# EAGLE design ODU Display Line 0603 (EAGLE 9.6.2)
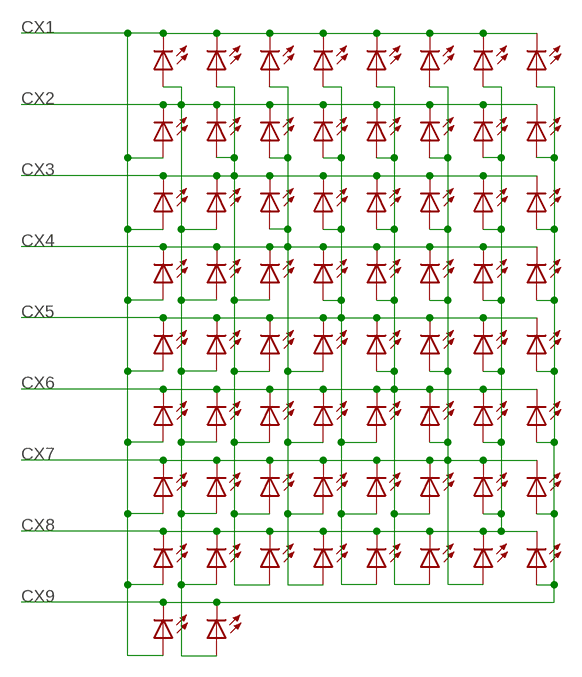
[diagram p0: schematic, sheet 1]

## Parts
LED_A1  LEDSMT0603_1  [CHIPLED_0603]
LED_A2  LEDSMT0603_1  [CHIPLED_0603]
LED_A3  LEDSMT0603_1  [CHIPLED_0603]
LED_A4  LEDSMT0603_1  [CHIPLED_0603]
LED_B1  LEDSMT0603_1  [CHIPLED_0603]
LED_B2  LEDSMT0603_1  [CHIPLED_0603]
LED_B3  LEDSMT0603_1  [CHIPLED_0603]
LED_B4  LEDSMT0603_1  [CHIPLED_0603]
LED_C1  LEDSMT0603_1  [CHIPLED_0603]
LED_C2  LEDSMT0603_1  [CHIPLED_0603]
LED_C3  LEDSMT0603_1  [CHIPLED_0603]
LED_C4  LEDSMT0603_1  [CHIPLED_0603]
LED_D1  LEDSMT0603_1  [CHIPLED_0603]
LED_D2  LEDSMT0603_1  [CHIPLED_0603]
LED_D3  LEDSMT0603_1  [CHIPLED_0603]
LED_D4  LEDSMT0603_1  [CHIPLED_0603]
LED_E1  LEDSMT0603_1  [CHIPLED_0603]
LED_E2  LEDSMT0603_1  [CHIPLED_0603]
LED_E3  LEDSMT0603_1  [CHIPLED_0603]
LED_E4  LEDSMT0603_1  [CHIPLED_0603]
LED_F1  LEDSMT0603_1  [CHIPLED_0603]
LED_F2  LEDSMT0603_1  [CHIPLED_0603]
LED_F3  LEDSMT0603_1  [CHIPLED_0603]
LED_F4  LEDSMT0603_1  [CHIPLED_0603]
LED_G1  LEDSMT0603_1  [CHIPLED_0603]
LED_G2  LEDSMT0603_1  [CHIPLED_0603]
LED_G3  LEDSMT0603_1  [CHIPLED_0603]
LED_G4  LEDSMT0603_1  [CHIPLED_0603]
LED_H1  LEDSMT0603_1  [CHIPLED_0603]
LED_H2  LEDSMT0603_1  [CHIPLED_0603]
LED_H3  LEDSMT0603_1  [CHIPLED_0603]
LED_H4  LEDSMT0603_1  [CHIPLED_0603]
LED_K1  LEDSMT0603_1  [CHIPLED_0603]
LED_K2  LEDSMT0603_1  [CHIPLED_0603]
LED_K3  LEDSMT0603_1  [CHIPLED_0603]
LED_K4  LEDSMT0603_1  [CHIPLED_0603]
LED_M1  LEDSMT0603_1  [CHIPLED_0603]
LED_M2  LEDSMT0603_1  [CHIPLED_0603]
LED_M3  LEDSMT0603_1  [CHIPLED_0603]
LED_M4  LEDSMT0603_1  [CHIPLED_0603]
LED_N1  LEDSMT0603_1  [CHIPLED_0603]
LED_N2  LEDSMT0603_1  [CHIPLED_0603]
LED_N3  LEDSMT0603_1  [CHIPLED_0603]
LED_N4  LEDSMT0603_1  [CHIPLED_0603]
LED_P1  LEDSMT0603_1  [CHIPLED_0603]
LED_P2  LEDSMT0603_1  [CHIPLED_0603]
LED_P3  LEDSMT0603_1  [CHIPLED_0603]
LED_P4  LEDSMT0603_1  [CHIPLED_0603]
LED_R1  LEDSMT0603_1  [CHIPLED_0603]
LED_R2  LEDSMT0603_1  [CHIPLED_0603]
LED_R3  LEDSMT0603_1  [CHIPLED_0603]
LED_R4  LEDSMT0603_1  [CHIPLED_0603]
LED_S1  LEDSMT0603_1  [CHIPLED_0603]
LED_S2  LEDSMT0603_1  [CHIPLED_0603]
LED_S3  LEDSMT0603_1  [CHIPLED_0603]
LED_S4  LEDSMT0603_1  [CHIPLED_0603]
LED_SEL1  LEDSMT0603_1  [CHIPLED_0603]
LED_SEL2  LEDSMT0603_1  [CHIPLED_0603]
LED_T1  LEDSMT0603_1  [CHIPLED_0603]
LED_T2  LEDSMT0603_1  [CHIPLED_0603]
LED_T3  LEDSMT0603_1  [CHIPLED_0603]
LED_T4  LEDSMT0603_1  [CHIPLED_0603]
LED_U1  LEDSMT0603_1  [CHIPLED_0603]
LED_U2  LEDSMT0603_1  [CHIPLED_0603]
LED_U3  LEDSMT0603_1  [CHIPLED_0603]
LED_U4  LEDSMT0603_1  [CHIPLED_0603]

## Nets
CX1: LED_A1.C LED_A2.A LED_A3.A LED_A4.A LED_B1.C LED_C1.C LED_D1.C LED_E1.C LED_F1.C LED_G1.C LED_H1.C LED_K1.A LED_K2.A LED_K3.A LED_K4.A LED_SEL1.A
CX2: LED_A1.A LED_B2.A LED_B3.A LED_B4.A LED_K1.C LED_M1.C LED_M2.A LED_M3.A LED_M4.A LED_N1.C LED_P1.C LED_R1.C LED_S1.C LED_SEL2.A LED_T1.C LED_U1.C
CX3: LED_A2.C LED_B1.A LED_B2.C LED_C2.C LED_C3.A LED_C4.A LED_D2.C LED_E2.C LED_F2.C LED_G2.C LED_H2.C LED_M1.A LED_N2.A LED_N3.A LED_N4.A
CX4: LED_C1.A LED_C2.A LED_D3.A LED_D4.A LED_K2.C LED_M2.C LED_N1.A LED_N2.C LED_P2.C LED_P3.A LED_P4.A LED_R2.C LED_S2.C LED_T2.C LED_U2.C
CX5: LED_A3.C LED_B3.C LED_C3.C LED_D1.A LED_D2.A LED_D3.C LED_E3.C LED_E4.A LED_F3.C LED_G3.C LED_H3.C LED_P1.A LED_P2.A LED_R3.A LED_R4.A
CX6: LED_E1.A LED_E2.A LED_E3.A LED_F4.A LED_K3.C LED_M3.C LED_N3.C LED_P3.C LED_R1.A LED_R2.A LED_R3.C LED_S3.C LED_S4.A LED_T3.C LED_U3.C
CX7: LED_A4.C LED_B4.C LED_C4.C LED_D4.C LED_E4.C LED_F1.A LED_F2.A LED_F3.A LED_F4.C LED_G4.C LED_H4.C LED_S1.A LED_S2.A LED_S3.A LED_T4.A
CX8: LED_G1.A LED_G2.A LED_G3.A LED_G4.A LED_K4.C LED_M4.C LED_N4.C LED_P4.C LED_R4.C LED_S4.C LED_T1.A LED_T2.A LED_T3.A LED_T4.C LED_U4.C
CX9: LED_H1.A LED_H2.A LED_H3.A LED_H4.A LED_SEL1.C LED_SEL2.C LED_U1.A LED_U2.A LED_U3.A LED_U4.A

## Library data of the parts
LED_A1-LED_A4 LED_B1-LED_B4 LED_C1-LED_C4 LED_D1-LED_D4 LED_E1-LED_E4 LED_F1-LED_F4 LED_G1-LED_G4 LED_H1-LED_H4 LED_K1-LED_K4 LED_M1-LED_M4 LED_N1-LED_N4 LED_P1-LED_P4 LED_R1-LED_R4 LED_S1-LED_S4 LED_SEL1 LED_SEL2 LED_T1-LED_T4 LED_U1-LED_U4 = 000_nl2:LED: LED KINGBRIGHT: KPTL-3216 are the reverse LEDs Source: www.kingbright.com

## Board
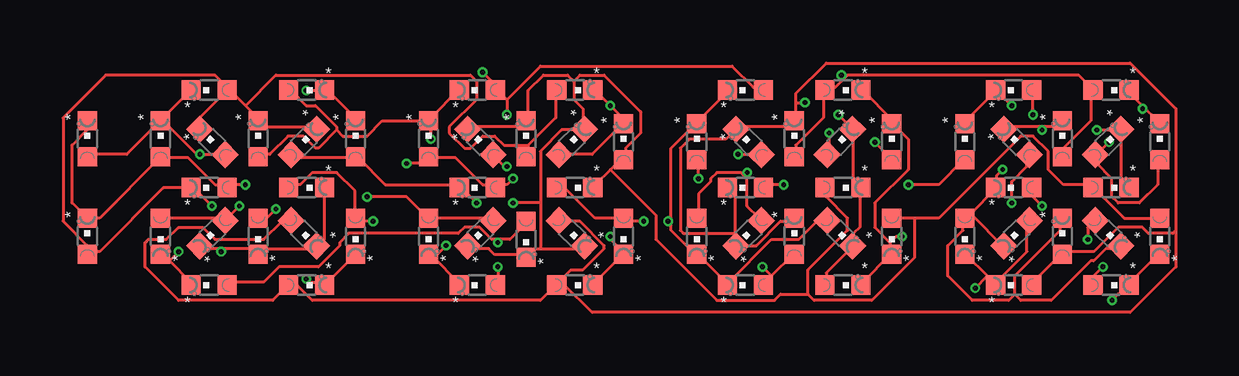
[diagram p1: board, top side]
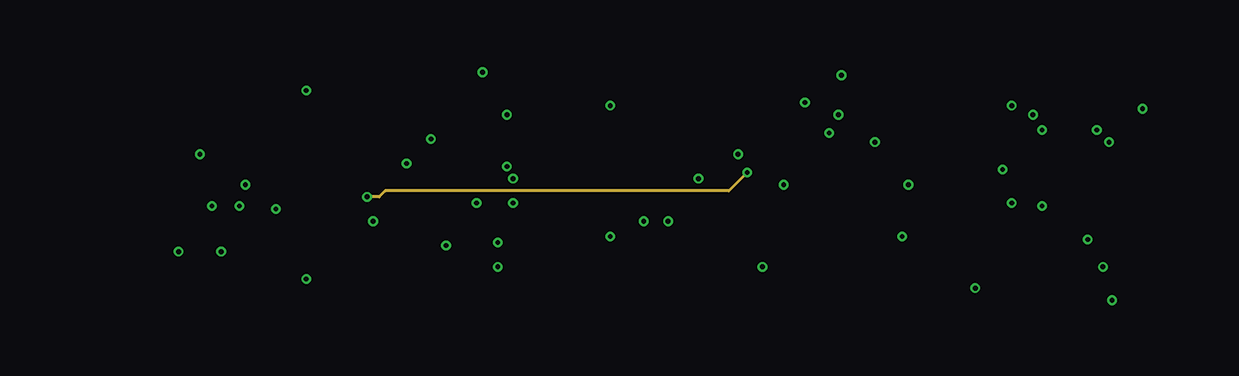
[diagram p2: board, inner layer Route15]
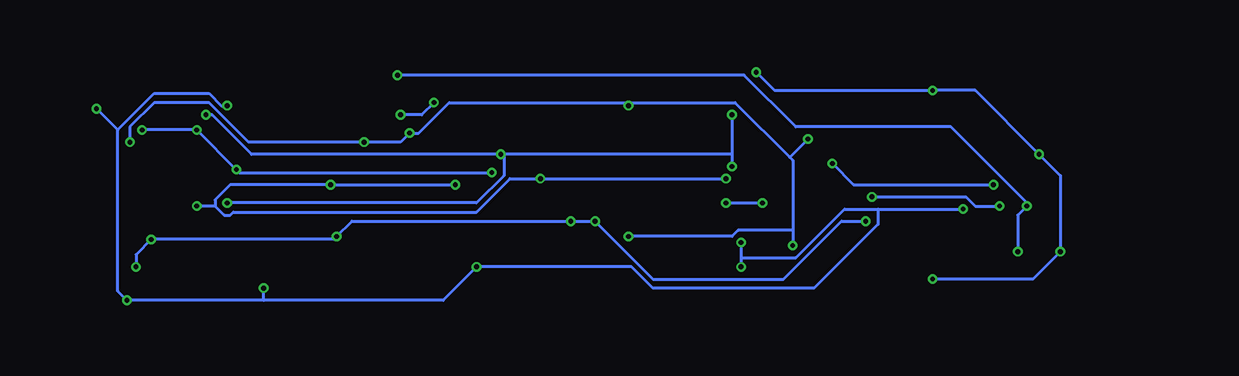
[diagram p3: board, bottom side, seen from below]

No outline drawn. Coordinates in mm, seen from the top.
Copper layers (1*2*15*16): Top 0.035559375mm / dielectric 0.17018125mm / Route2 0.01778125mm / dielectric 47mil / Route15 0.01778125mm / dielectric 0.17018125mm / Bottom 0.035559375mm
Design rules "jlcpcb-4-layer": minimum track width 5mil, minimum drill 0.2mm, track to track 0.126490625mm, track to pad 0.126490625mm, pad to pad 0.126490625mm, via to via 0.126490625mm, smd to smd 0mil, copper to edge 0.1mm, drill to drill 5mil, minimum pad ring 4mil, minimum via ring 4mil, stop-mask expansion 3mil, vias tented up to drill 100mil, thermal gap 10mil

### Footprints (pad centres in the part's own frame; a part is rotated, then mirrored left to right if it is on the bottom)
CHIPLED_0603 = smd 0.8 x 0.8: A 0,-0.75; C 0,0.75

### Placement (x,y rotation side)
LED_A1  5.71,8.76 90 top
LED_A2  16.89,8.76 90 top
LED_A3  28.07,8.76 90 top
LED_A4  39.24,8.76 90 top
LED_B1  9.78,8.76 270 top
LED_B2  20.95,8.76 270 top
LED_B3  32.13,8.76 270 top
LED_B4  43.31,8.76 270 top
LED_C1  11.81,6.73 0 top
LED_C2  22.99,6.6 0 top
LED_C3  34.16,6.6 0 top
LED_C4  45.34,6.6 0 top
LED_D1  11.81,2.67 180 top
LED_D2  22.99,2.67 180 top
LED_D3  34.16,2.67 180 top
LED_D4  45.34,2.67 180 top
LED_E1  9.78,0.64 270 top
LED_E2  20.95,0.64 270 top
LED_E3  32.13,0.64 270 top
LED_E4  43.31,0.64 270 top
LED_F1  5.71,0.64 90 top
LED_F2  16.89,0.64 90 top
LED_F3  28.07,0.64 90 top
LED_F4  39.24,0.64 90 top
LED_G1  3.68,2.67 180 top
LED_G2  14.86,2.67 180 top
LED_G3  26.04,2.67 180 top
LED_G4  37.21,2.67 180 top
LED_H1  3.68,6.73 0 top
LED_H2  14.86,6.73 0 top
LED_H3  26.04,6.6 0 top
LED_H4  37.21,6.6 0 top
LED_K1  5.84,6.6 45 top
LED_K2  17.02,6.6 45 top
LED_K3  28.19,6.6 45 top
LED_K4  39.37,6.6 45 top
LED_M1  7.75,6.73 0 top
LED_M2  18.92,6.73 0 top
LED_M3  30.1,6.73 0 top
LED_M4  41.27,6.73 0 top
LED_N1  9.65,6.6 315 top
LED_N2  20.83,6.6 315 top
LED_N3  32,6.6 315 top
LED_N4  43.18,6.6 315 top
LED_P1  9.78,4.7 270 top
LED_P2  20.95,4.7 270 top
LED_P3  32.13,4.7 270 top
LED_P4  43.31,4.7 270 top
LED_R1  9.65,2.79 225 top
LED_R2  20.83,2.79 225 top
LED_R3  32,2.79 225 top
LED_R4  43.18,2.79 225 top
LED_S1  7.75,2.67 180 top
LED_S2  18.92,2.54 180 top
LED_S3  30.1,2.67 0 top
LED_S4  41.27,2.67 0 top
LED_SEL1  0.64,6.73 0 top
LED_SEL2  0.64,2.67 0 top
LED_T1  5.84,2.79 135 top
LED_T2  17.02,2.79 135 top
LED_T3  28.19,2.79 135 top
LED_T4  39.37,2.79 135 top
LED_U1  5.71,4.7 90 top
LED_U2  16.89,4.7 90 top
LED_U3  28.07,4.7 90 top
LED_U4  39.24,4.7 90 top

### Tracks (layer width: path | path; a pad name or v marks a point on that pad's centre or on a via)
CX1  (via drill 0.2)
  Top 0.127: LED_C1.C 11.79,7.61 10.65,8.74 LED_B1.C 10.52,8.74 v9.76,8.74 | LED_D1.C 11.79,1.9 10.65,0.76 LED_E1.C 10.52,0.76 9.89,0.76 v9.76,0.89 | 4.06,1.65 4.94,0.76 LED_F1.C | 4.06,1.65 3.8,1.9 LED_G1.C 4.06,1.65 | LED_SEL1.A 0.76,6.08 2.28,6.08 LED_H1.C | LED_K1.A 6.34,6.08 v5.32,6.08 5.2,6.08 3.8,7.48 LED_H1.C | LED_A1.C 4.94,8.74 3.8,7.61 LED_H1.C | v4.44,2.03 4.06,1.65 | v18.12,5.58 18,5.58 17.62,5.96 LED_K2.A | 18.12,8.37 v18.12,7.73 | 18.12,8.37 17.74,8.74 LED_A2.A 17.74,8.87 v17.11,9.51 | v27.76,6.08 28.64,6.08 LED_K3.A | 18.12,8.37 19.52,9.76 27.5,9.76 28.39,8.87 28.77,8.87 LED_A3.A | v39.16,4.06 39.16,4.94 39.8,5.58 39.8,5.96 LED_K4.A | v40.05,7.73 40.05,8.74 LED_A4.A
  Bottom 0.127: v9.76,0.89 5.58,0.89 v4.44,2.03 4.44,5.2 v5.32,6.08 7.99,8.74 v9.76,8.74 16.35,8.74 v17.11,9.51 | v18.12,7.73 18.12,6.08 | 18.12,6.08 v18.12,5.58 | 18.12,6.08 27.63,6.08 | v39.16,4.06 28.77,4.06 27.63,5.2 27.63,6.08 | 27.63,6.08 v27.76,6.08 38.15,6.08 39.8,7.73 v40.05,7.73
CX2  (via drill 0.2)
  Top 0.127: LED_M3.A 30.16,6.08 30.16,6.46 31.31,7.61 31.31,8.74 LED_B3.A 31.43,8.87 31.81,8.87 32.19,9.25 | LED_M4.A 41.32,6.08 41.32,6.34 42.46,7.48 42.46,8.74 LED_B4.A 42.46,8.87 41.95,9.38 32.32,9.38 32.19,9.25 | 6.21,2.15 7.61,2.15 7.73,2.03 LED_S1.C 7.86,2.03 7.99,2.15 10.14,2.15 LED_R1.C 10.27,2.28 10.52,2.54 LED_P1.C | 6.21,2.15 5.32,2.15 LED_T1.C | 19.01,6.46 19.01,6.08 LED_M2.A | 19.01,6.46 20.15,7.61 20.15,8.74 LED_B2.A | LED_K1.C 5.32,7.22 5.32,7.61 6.46,8.74 LED_A1.A | 7.22,8.11 6.59,8.74 LED_A1.A | 7.22,8.11 7.73,7.61 LED_M1.C 7.86,7.48 8.11,7.22 10.14,7.22 LED_N1.C | 19.01,6.46 18,6.46 17.62,6.84 17.11,6.84 16.6,6.34 16.35,6.34 15.72,6.97 15.72,7.22 16.86,8.37 16.86,9.13 16.6,9.38 8.49,9.38 7.22,8.11 | LED_A1.A 6.46,8.87 5.96,9.38 1.39,9.38 -0.38,7.61 -0.38,3.29 0.63,2.28 0.63,2.03 LED_SEL2.A 0.76,2.03 1.14,2.03 3.8,4.69 4.94,4.69 LED_U1.C 5.07,4.69 v5.83,3.93 | v6.21,2.03 6.21,2.15 | v32.07,9.38 32.19,9.25
  Bottom 0.127: v6.21,2.03 6.21,3.55 v5.83,3.93 5.83,4.06 9,7.22 15.46,7.22 17.62,9.38 v32.07,9.38
CX3  (via drill 0.2)
  Top 0.127: LED_H2.C 14.96,7.61 16.1,8.74 LED_A2.C | 11.03,7.1 10.27,6.34 10.14,6.34 9.63,6.84 9,6.84 8.24,6.08 7.86,6.08 LED_M1.A | 11.03,7.1 11.03,7.22 10.14,8.11 9.76,8.11 9.13,8.74 LED_B1.A | 11.03,7.1 11.28,6.84 12.29,6.84 12.93,7.48 14.83,7.48 LED_H2.C | LED_N2.A 20.41,6.08 21.67,6.08 22.94,7.35 LED_C2.C 23.07,7.48 v22.43,8.11 21.8,8.74 LED_B2.C | LED_C4.A 45.25,5.83 45.25,4.82 44.49,4.06 43.6,4.06 43.35,4.31 43.35,5.07 42.71,5.7 42.71,5.96 LED_N4.A 42.71,6.08 v43.22,6.59 | LED_E2.C 21.8,0.76 22.94,1.9 LED_D2.C 22.94,2.03 22.43,2.54 v22.43,2.66 | 15.08,1.77 16.1,0.76 LED_F2.C | 15.08,1.77 14.96,1.9 LED_G2.C 15.08,1.77 | v33.46,6.59 34.09,5.96 LED_C3.A | v31.56,6.97 31.56,6.08 LED_N3.A | v15.59,2.28 15.08,1.77 | v14.96,6.72 14.96,7.48 LED_H2.C
  Bottom 0.127: 15.59,2.92 15.59,5.83 15.72,5.96 | 15.59,2.92 v15.59,2.28 | 15.72,5.96 18,8.24 22.43,8.24 | 22.43,8.24 29.91,8.24 31.18,6.97 v31.56,6.97 31.94,6.59 v33.46,6.59 38.28,6.59 39.92,8.24 42.21,8.24 43.22,7.22 v43.22,6.59 | v22.43,2.66 18.12,2.66 17.87,2.92 15.59,2.92 | 22.43,8.24 v22.43,8.11 | 15.72,5.96 v14.96,6.72
CX4  (via drill 0.2)
  Top 0.127: 35.11,3.42 36.12,3.42 39.54,6.84 40.05,6.84 40.69,6.21 40.69,5.45 41.32,4.82 42.46,4.82 LED_P4.A 42.59,4.69 43.85,3.42 45.25,3.42 LED_D4.A | 35.11,3.42 34.22,3.42 LED_D3.A | 30.67,0.25 30.67,1.27 32.32,2.92 32.32,3.42 31.43,4.31 31.43,4.69 LED_P3.A | 30.67,0.25 30.93,0 33.33,0 35.11,1.77 35.11,3.42 | LED_N1.A 9.13,5.96 11.79,5.96 LED_C1.A 11.91,5.96 13.05,4.82 16.1,4.82 LED_U2.C 16.22,4.69 v16.86,4.06 | LED_T2.C 16.6,2.15 17.36,2.15 17.62,1.9 18.89,1.9 LED_S2.C 19.01,1.9 19.27,2.15 19.52,2.15 | 19.52,2.15 21.29,2.15 LED_R2.C | 22.43,5.45 22.94,5.96 LED_C2.A 23.07,5.96 23.07,6.34 23.7,6.97 23.7,7.86 22.18,9.38 21.17,9.38 20.91,9.13 | 22.43,5.45 21.8,4.82 LED_P2.C | LED_K2.C 16.6,7.22 18.63,7.22 18.89,7.48 LED_M2.C 19.01,7.61 19.01,8.74 19.64,9.38 20.66,9.38 20.91,9.13 | 20.91,9.13 20.91,8.37 21.29,7.99 21.29,7.22 LED_N2.C 21.29,7.1 20.41,7.1 19.52,6.21 19.52,4.06 | 19.52,4.06 19.52,2.15 | 19.52,4.06 v18.38,4.06 | 30.67,0.25 29.53,0.25 29.28,0 26.87,0 24.34,2.54 24.34,3.55 22.43,5.45
  Bottom 0.127: v18.38,4.06 v16.86,4.06
CX5  (via drill 0.2)
  Top 0.127: LED_A3.C 27.38,8.74 26.11,7.48 LED_H3.C 25.98,7.35 24.97,6.34 24.97,3.29 | LED_R3.A 31.43,3.29 31.05,3.29 30.29,2.54 29.15,2.54 27.38,0.76 LED_F3.C 27.25,0.76 26.11,1.9 LED_G3.C 25.98,1.9 24.97,2.92 24.97,3.29 | LED_P1.A 9.13,4.82 9.51,4.82 10.01,5.32 11.03,5.32 11.79,4.56 11.79,3.42 LED_D1.A 11.91,3.29 v12.55,3.29 | LED_P2.A 20.28,4.69 20.53,4.69 21.8,3.42 22.94,3.42 LED_D2.A 23.07,3.29 v23.83,3.29 | v42.97,1.39 42.59,1.01 42.59,0.76 LED_E4.A | v42.33,2.54 42.33,3.04 42.59,3.29 LED_R4.A | LED_E3.C 32.95,0.76 34.09,1.9 LED_D3.C 34.09,2.03 34.09,2.41 | LED_B3.C 32.95,8.74 34.22,7.48 LED_C3.C 34.22,7.35 34.85,6.72 34.85,5.45 33.46,4.06 33.46,3.04 34.09,2.41 | v34.6,2.66 34.35,2.66 34.09,2.41 | v24.84,3.29 24.97,3.29
  Bottom 0.127: v42.97,1.39 42.97,1.9 v42.33,2.54 34.73,2.54 v34.6,2.66 33.97,3.29 v24.84,3.29 v23.83,3.29 21.42,0.89 15.97,0.89 13.56,3.29 v12.55,3.29
CX6  (via drill 0.2)
  Top 0.127: LED_E2.A 20.15,0.63 19.52,0 10.01,0 9.38,0.63 9.13,0.63 LED_E1.A 9,0.63 8.37,0 4.44,0 3.04,1.39 3.04,2.41 3.17,2.54 3.93,2.54 4.44,3.04 5.45,3.04 5.96,2.54 7.99,2.54 8.74,3.29 9,3.29 LED_R1.A | LED_R2.A 20.41,3.29 21.17,3.29 22.18,2.28 22.18,2.15 21.29,1.27 20.79,1.27 20.28,0.76 LED_E2.A | LED_E3.A 31.43,0.76 31.43,1.14 32.45,2.15 LED_R3.C 32.57,2.28 32.57,2.79 32.83,3.04 32.83,4.69 LED_P3.C 32.83,4.82 32.57,5.07 32.57,7.1 LED_N3.C 32.45,7.22 v31.94,7.73 | 27.63,2.79 27.63,4.44 27.38,4.69 LED_U3.C | 27.63,2.79 27.63,2.28 LED_T3.C | LED_S3.C 30.04,3.29 29.53,3.29 28.52,2.28 27.76,2.28 LED_T3.C | LED_F4.A 40.05,0.76 41.19,1.9 LED_S4.A 41.32,2.03 42.59,2.03 43.6,3.04 44.61,3.04 44.87,2.79 45.88,2.79 46.01,2.92 | 46.01,2.92 46.01,7.99 44.11,9.89 31.43,9.89 30.16,8.62 30.16,8.24 | 30.16,8.24 30.16,7.61 LED_M3.C 30.04,7.48 29.79,7.22 27.76,7.22 LED_K3.C 27.63,7.1 27.25,6.72 25.73,6.72 25.35,6.34 25.35,2.92 25.48,2.79 27.63,2.79 | 27.63,2.79 LED_T3.C | 30.16,8.24 v30.55,8.24 | 46.01,2.92 46.01,1.39 44.11,-0.51 21.67,-0.51 20.53,0.63 20.28,0.63 LED_E2.A
  Bottom 0.127: v31.94,7.73 31.05,7.73 v30.55,8.24
CX7  (via drill 0.2)
  Top 0.127: 38.15,1.01 37.26,1.9 LED_G4.C | 38.15,1.01 38.4,0.76 LED_F4.C | LED_T4.A 39.8,3.29 39.8,2.03 38.53,0.76 LED_F4.C | 44.61,8.11 43.98,8.74 LED_B4.C | 44.61,8.11 45.25,7.48 LED_C4.C | 38.53,8.74 37.26,7.48 LED_H4.C | LED_D4.C 45.25,1.9 44.11,0.76 LED_E4.C 43.98,0.63 v43.35,0 | 29.15,1.01 30.04,1.9 LED_S3.A | 29.15,1.01 28.9,0.76 LED_F3.A 29.15,1.01 | 17.74,2.54 18.25,2.54 18.89,3.17 LED_S2.A | 17.74,2.54 17.49,2.54 16.98,3.04 16.35,3.04 16.1,2.79 11.53,2.79 11.15,2.41 11.15,2.28 10.27,1.39 8.62,1.39 7.99,0.76 6.59,0.76 LED_F1.A | v17.74,1.39 17.74,0.76 LED_F2.A | 17.74,2.54 v17.74,2.41 | v8.49,3.8 8.11,3.42 7.86,3.42 LED_S1.A | v28.77,1.39 29.15,1.01 | v39.16,8.11 38.53,8.74 | 38.53,8.74 LED_A4.C | v44.61,7.99 44.61,8.11 | v37.64,0.51 38.15,1.01 | 38.15,1.01 LED_F4.C
  Bottom 0.127: v17.74,2.41 17.74,1.77 | 17.74,1.77 v17.74,1.39 | 12.04,3.8 13.44,3.8 15.46,1.77 17.74,1.77 | 12.04,3.8 v8.49,3.8 | 12.04,3.8 12.04,3.17 14.7,0.51 21.42,0.51 22.31,1.39 v28.77,1.39 30.16,0 37.64,0 | 37.64,0 v43.35,0 43.73,0.38 43.73,7.1 | v39.16,8.11 39.42,8.11 39.92,8.62 42.21,8.62 43.73,7.1 | 43.73,7.1 v44.61,7.99 | 37.64,0 v37.64,0.51
CX8  (via drill 0.2)
  Top 0.127: LED_G1.A 3.8,3.42 6.34,3.42 LED_T1.A 6.46,3.42 v6.97,3.93 | LED_T2.A 17.49,3.42 14.96,3.42 LED_G2.A 14.83,3.42 13.94,4.31 v12.29,4.31 | 37.39,3.55 38.53,4.69 LED_U4.C 38.53,4.82 38.53,5.2 v38.78,5.45 | 37.39,3.55 37.26,3.42 LED_G4.A | 37.39,3.55 37.52,3.55 38.78,2.28 LED_T4.C | 37.39,3.55 LED_G4.A | 39.29,0.25 39.29,1.01 41.19,2.92 41.19,3.29 LED_S4.C | 39.29,0.25 39.54,0 40.81,0 42.46,1.65 42.59,1.65 43.09,2.15 43.6,2.15 LED_R4.C | 39.29,0.25 39.04,0 37.52,0 36.5,1.01 36.5,2.28 37.14,2.92 37.14,3.29 LED_G4.A | 28.01,5.2 28.14,5.07 28.14,3.93 28.64,3.42 LED_T3.A | 28.01,5.2 27.88,5.32 26.87,5.32 26.62,5.07 26.62,4.94 26.11,4.44 26.11,3.42 LED_G3.A | LED_P4.C 43.98,4.82 43.73,5.07 43.73,7.1 LED_N4.C 43.6,7.1 v42.71,7.1 | 40.43,7.22 40.94,7.22 41.19,7.48 LED_M4.C | 40.43,7.22 38.91,7.22 LED_K4.C | 40.43,7.22 v40.43,7.1 | v28.14,5.32 28.01,5.2
  Route15 0.127: v12.29,4.31 12.8,4.31 13.05,4.56 27.38,4.56 v28.14,5.32
  Bottom 0.127: v6.97,3.93 7.99,3.93 8.37,4.31 v12.29,4.31 | v42.71,7.1 v40.43,7.1 v38.78,5.45 38.66,5.32 v28.14,5.32
CX9  (via drill 0.2)
  Top 0.127: LED_SEL1.C 0.63,7.1 0,6.46 0,4.06 LED_SEL2.C 0.76,3.42 1.14,3.42 3.68,5.96 LED_H1.A 3.8,5.96 4.82,5.96 5.96,4.82 6.46,4.82 LED_U1.A 6.59,4.82 v7.22,4.82 | v29.66,4.82 28.9,4.82 LED_U3.A | v34.85,4.82 36.12,4.82 37.14,5.83 LED_H4.A | v26.11,5.07 26.11,5.83 LED_H3.A | v40.43,3.93 40.05,4.31 40.05,4.69 LED_U4.A | v18.38,5.07 18.12,4.82 17.74,4.82 LED_U2.A 17.62,4.82 17.11,4.82 15.97,5.96 14.96,5.96 LED_H2.A 14.83,5.96 14.58,5.7 v13.94,5.7
  Bottom 0.127: v29.66,4.82 v34.85,4.82 39.04,4.82 39.67,4.18 39.67,3.93 | 39.67,3.93 39.29,3.55 39.04,3.55 38.91,3.68 28.77,3.68 27.38,5.07 v26.11,5.07 v18.38,5.07 | 39.67,3.93 v40.43,3.93 | v7.22,4.82 13.05,4.82 v13.94,5.7